# Altium schematic sheet VFD Ura Display.SchDoc
size A3
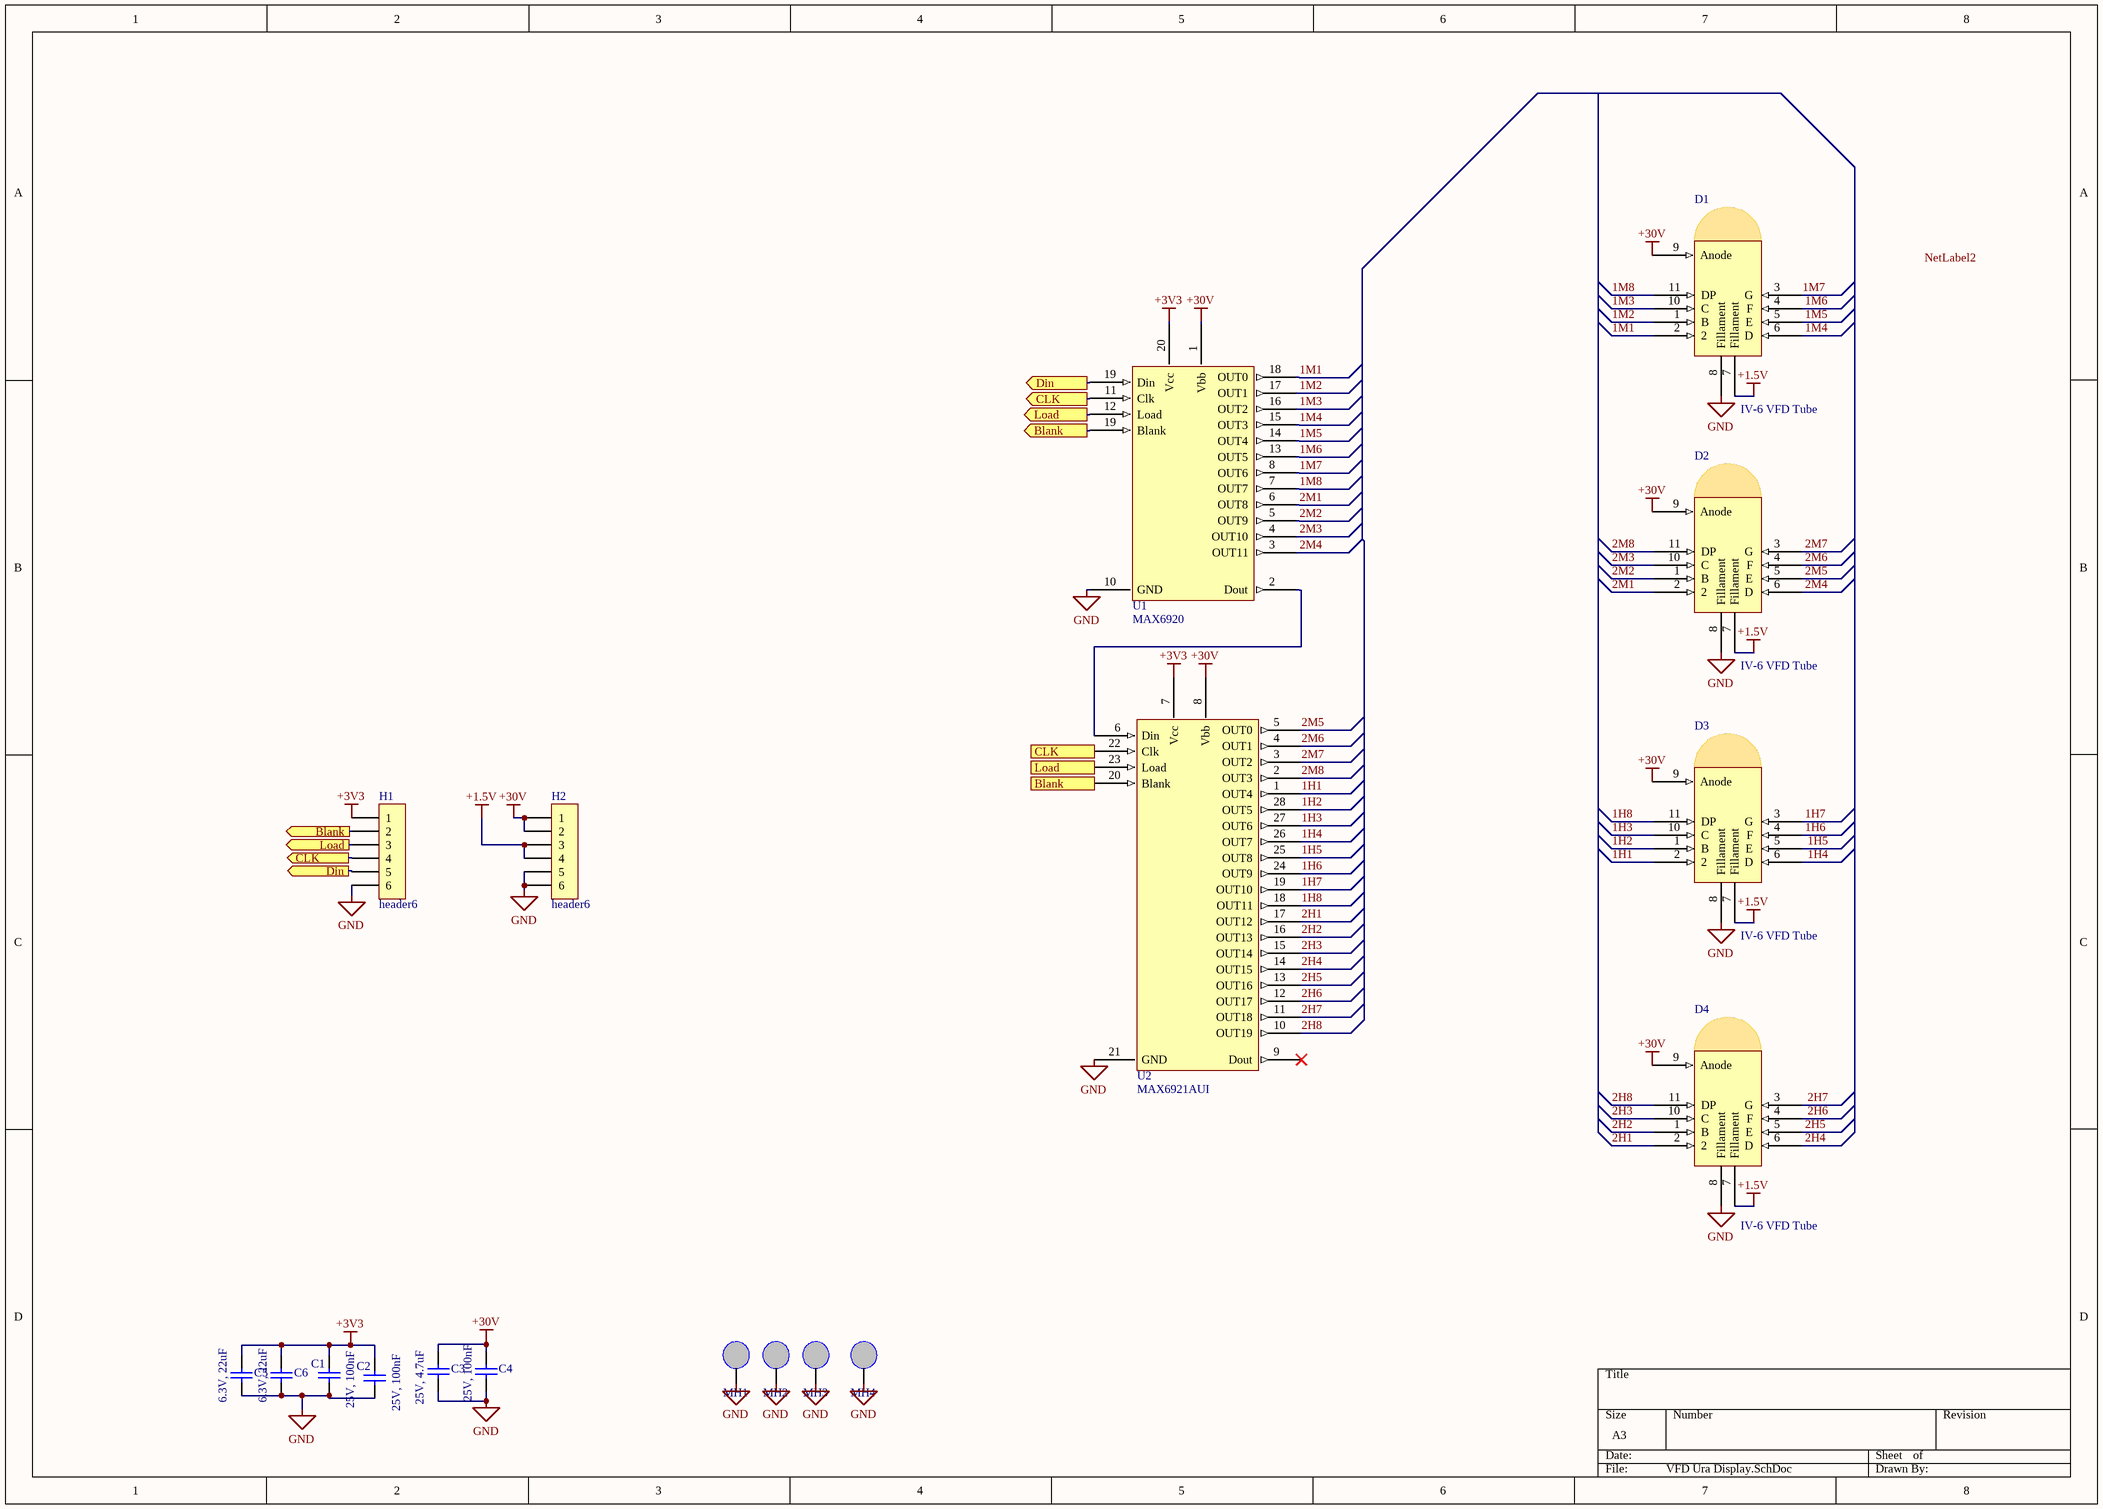
[diagram p0: VFD Ura Display.SchDoc]

## Parts
C1  25V, 100nF  [0603_1.6x0.8x0.8mm_Reflow Soldering]
C2  25V, 100nF  [0603_1.6x0.8x0.8mm_Reflow Soldering]
C3  25V, 4.7uF  [0805_2x1.25x1.25mm_Reflow Soldering]
C4  25V, 100nF  [0603_1.6x0.8x0.8mm_Reflow Soldering]
C5  6.3V, 22uF  [0805_2x1.25x1.25mm_Reflow Soldering]
C6  6.3V, 22uF  [0805_2x1.25x1.25mm_Reflow Soldering]
D1  IV-6 VFD Tube  [IV-6]
D2  IV-6 VFD Tube  [IV-6]
D3  IV-6 VFD Tube  [IV-6]
D4  IV-6 VFD Tube  [IV-6]
H1  header6  [Letev6]
H2  header6  [Letev6]
MH1  Mounting Hole M3  [Mounting Hole M3]  (value not drawn)
MH2  Mounting Hole M3  [Mounting Hole M3]  (value not drawn)
MH3  Mounting Hole M3  [Mounting Hole M3]  (value not drawn)
MH4  Mounting Hole M3  [Mounting Hole M3]  (value not drawn)
U1  MAX6920  [SO20 Wide]
U2  MAX6921AUI  [TSOP 28]

## Ports
Blank (out), CLK (out), Din (out), Load (out)

## Nets
+1.5V: D1.7(Fillament) D2.7(Fillament) D3.7(Fillament) D4.7(Fillament) H2.3 H2.4
+3V3: C1.2 C2.2 C5.2 C6.2 H1.1 U1.20(Vcc) U2.7(Vcc)
+30V: C3.2 C4.2 D1.9(Anode) D2.9(Anode) D3.9(Anode) D4.9(Anode) H2.1 H2.2 U1.1(Vbb) U2.8(Vbb)
GND: C1.1 C2.1 C3.1 C4.1 C5.1 C6.1 D1.8(Fillament) D2.8(Fillament) D3.8(Fillament) D4.8(Fillament) H1.6 H2.5 H2.6 MH1.1 MH2.1 MH3.1 MH4.1 U1.10(GND) U2.21(GND)
1H1: D3.2 U2.1(OUT4)
1H2: D3.1(B) U2.28(OUT5)
1H3: D3.10(C) U2.27(OUT6)
1H4: D3.6(D) U2.26(OUT7)
1H5: D3.5(E) U2.25(OUT8)
1H6: D3.4(F) U2.24(OUT9)
1H7: D3.3(G) U2.19(OUT10)
1H8: D3.11(DP) U2.18(OUT11)
1M1: D1.2 U1.18(OUT0)
1M2: D1.1(B) U1.17(OUT1)
1M3: D1.10(C) U1.16(OUT2)
1M4: D1.6(D) U1.15(OUT3)
1M5: D1.5(E) U1.14(OUT4)
1M6: D1.4(F) U1.13(OUT5)
1M7: D1.3(G) U1.8(OUT6)
1M8: D1.11(DP) U1.7(OUT7)
2H1: D4.2 U2.17(OUT12)
2H2: D4.1(B) U2.16(OUT13)
2H3: D4.10(C) U2.15(OUT14)
2H4: D4.6(D) U2.14(OUT15)
2H5: D4.5(E) U2.13(OUT16)
2H6: D4.4(F) U2.12(OUT17)
2H7: D4.3(G) U2.11(OUT18)
2H8: D4.11(DP) U2.10(OUT19)
2M1: D2.2 U1.6(OUT8)
2M2: D2.1(B) U1.5(OUT9)
2M3: D2.10(C) U1.4(OUT10)
2M4: D2.6(D) U1.3(OUT11)
2M5: D2.5(E) U2.5(OUT0)
2M6: D2.4(F) U2.4(OUT1)
2M7: D2.3(G) U2.3(OUT2)
2M8: D2.11(DP) U2.2(OUT3)
Blank: H1.2 U1.19(Blank) U2.20(Blank) ; port Blank
CLK: H1.4 U1.11(Clk) U2.22(Clk) ; port CLK
Din: H1.5 U1.19(Din) ; port Din
Load: H1.3 U1.12(Load) U2.23(Load) ; port Load
NetU1_2: U1.2(Dout) U2.6(Din)

Not connected (* = marked no-connect by the designer): U2 9(Dout)*

## Notes on the sheet
- Labels drawn without touching a wire or pin: NetLabel2

## Library data of the parts
C1 C2 C4 = 885012206071: WCAP-CSGP Ceramic Capacitors, 0603, X7R, 25V, 100nF; Rated Voltage: 25V DC; ComponentLink1Description: Manufacturer; ComponentLink1URL: http://www.we-online.de; ComponentLink2Description: Datasheet; ComponentLink2URL: http://katalog.we-online.de/pbs/datasheet/885012206071.pdf; Part Number: 885012206071; Published Date: Oct. 2017; Publisher: Wurth Elektronik; Size: 0603; Operating Temperature: -55 °C to +125 °C; Value: 100nF; Ceramic Type: X7R
C3 = 885012107018: WCAP-CSGP Ceramic Capacitors, 0805, X5R, 25V, 4.7uF; Rated Voltage: 25V DC; ComponentLink1Description: Manufacturer; ComponentLink1URL: http://www.we-online.de; ComponentLink2Description: Datasheet; ComponentLink2URL: http://katalog.we-online.de/pbs/datasheet/885012107018.pdf; Part Number: 885012107018; Published Date: Oct. 2017; Publisher: Wurth Elektronik; Size: 0805; Operating Temperature: -55 °C to +125 °C; Value: 4.7uF; Ceramic Type: X5R
C5 C6 = 885012107005: WCAP-CSGP Ceramic Capacitors, 0805, X5R, 6.3V, 22uF; Rated Voltage: 6.3V DC; ComponentLink1Description: Manufacturer; ComponentLink1URL: http://www.we-online.de; ComponentLink2Description: Datasheet; ComponentLink2URL: http://katalog.we-online.de/pbs/datasheet/885012107005.pdf; Part Number: 885012107005; Published Date: Oct. 2017; Publisher: Wurth Elektronik; Size: 0805; Operating Temperature: -55 °C to +125 °C; Value: 22uF; Ceramic Type: X5R
D1-D4 = IV-6